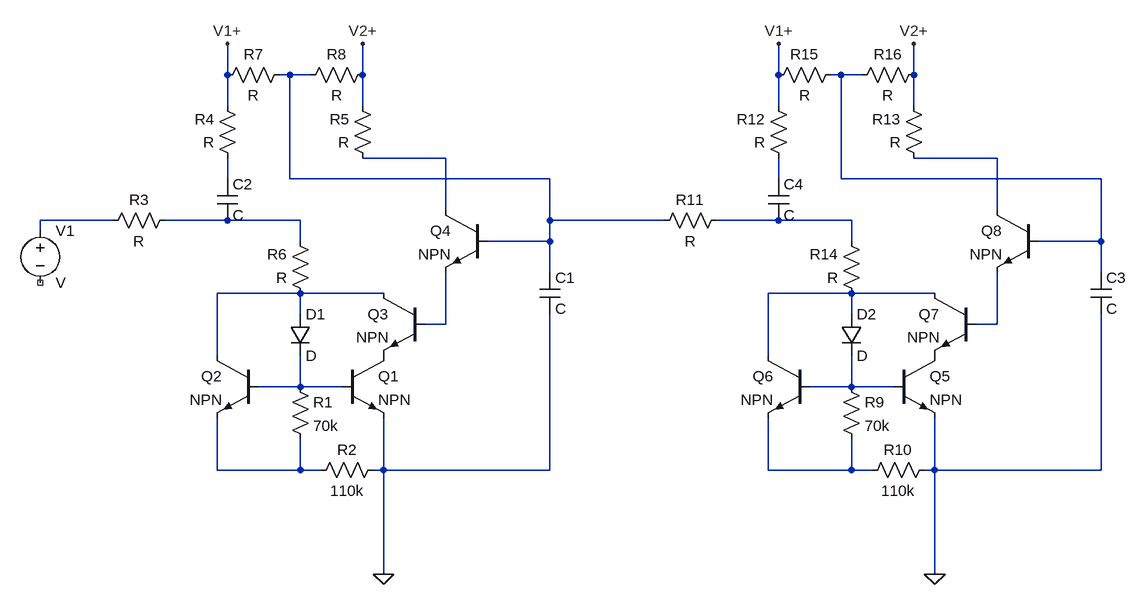
[diagram p0: schematic phantom current corrector.asc]
phantom current corrector.asc, the LTspice schematic file:
Version 4.1
SHEET 1 1512 680
WIRE 128 -304 128 -352
WIRE 224 -304 208 -304
WIRE 256 -304 224 -304
WIRE 336 -304 336 -352
WIRE 976 -304 976 -352
WIRE 1072 -304 1056 -304
WIRE 1104 -304 1072 -304
WIRE 1184 -304 1184 -352
WIRE 128 -256 128 -304
WIRE 336 -256 336 -304
WIRE 976 -256 976 -304
WIRE 1184 -256 1184 -304
WIRE 464 -176 336 -176
WIRE 1312 -176 1184 -176
WIRE 128 -144 128 -176
WIRE 224 -144 224 -304
WIRE 624 -144 224 -144
WIRE 976 -144 976 -176
WIRE 1072 -144 1072 -304
WIRE 1472 -144 1072 -144
WIRE 464 -96 464 -176
WIRE 1312 -96 1312 -176
WIRE -48 -80 -160 -80
WIRE 128 -80 32 -80
WIRE 240 -80 128 -80
WIRE 624 -80 624 -144
WIRE 800 -80 624 -80
WIRE 976 -80 880 -80
WIRE 1088 -80 976 -80
WIRE -160 -64 -160 -80
WIRE 240 -48 240 -80
WIRE 624 -48 624 -80
WIRE 624 -48 528 -48
WIRE 1088 -48 1088 -80
WIRE 1472 -48 1472 -144
WIRE 1472 -48 1376 -48
WIRE 624 0 624 -48
WIRE 1472 0 1472 -48
WIRE 240 32 112 32
WIRE 368 32 240 32
WIRE 1088 32 960 32
WIRE 1216 32 1088 32
WIRE 240 64 240 32
WIRE 1088 64 1088 32
WIRE 464 80 464 0
WIRE 464 80 432 80
WIRE 1312 80 1312 0
WIRE 1312 80 1280 80
WIRE 112 128 112 32
WIRE 960 128 960 32
WIRE 240 176 240 128
WIRE 240 176 176 176
WIRE 304 176 240 176
WIRE 1088 176 1088 128
WIRE 1088 176 1024 176
WIRE 1152 176 1088 176
WIRE 112 304 112 224
WIRE 240 304 240 256
WIRE 240 304 112 304
WIRE 272 304 240 304
WIRE 368 304 368 224
WIRE 368 304 352 304
WIRE 624 304 624 64
WIRE 624 304 368 304
WIRE 960 304 960 224
WIRE 1088 304 1088 256
WIRE 1088 304 960 304
WIRE 1120 304 1088 304
WIRE 1216 304 1216 224
WIRE 1216 304 1200 304
WIRE 1472 304 1472 64
WIRE 1472 304 1216 304
WIRE 368 464 368 304
WIRE 1216 464 1216 304
FLAG 368 464 0
FLAG 128 -352 V1+
FLAG 336 -352 V2+
FLAG 1216 464 0
FLAG 976 -352 V1+
FLAG 1184 -352 V2+
SYMBOL npn 304 128 R0
SYMATTR InstName Q1
SYMBOL npn 176 128 M0
SYMATTR InstName Q2
SYMBOL diode 224 64 R0
SYMATTR InstName D1
SYMBOL res 224 160 R0
SYMATTR InstName R1
SYMATTR Value 70k
SYMBOL res 368 288 R90
WINDOW 0 0 56 VBottom 2
WINDOW 3 32 56 VTop 2
SYMATTR InstName R2
SYMATTR Value 110k
SYMBOL npn 432 32 M0
SYMATTR InstName Q3
SYMBOL npn 528 -96 M0
SYMATTR InstName Q4
SYMBOL cap 608 0 R0
SYMATTR InstName C1
SYMBOL res 48 -96 R90
WINDOW 0 0 56 VBottom 2
WINDOW 3 32 56 VTop 2
SYMATTR InstName R3
SYMBOL res 144 -160 R180
WINDOW 0 36 76 Left 2
WINDOW 3 36 40 Left 2
SYMATTR InstName R4
SYMBOL res 352 -160 R180
WINDOW 0 36 76 Left 2
WINDOW 3 36 40 Left 2
SYMATTR InstName R5
SYMBOL res 256 48 R180
WINDOW 0 36 76 Left 2
WINDOW 3 36 40 Left 2
SYMATTR InstName R6
SYMBOL cap 112 -144 R0
SYMATTR InstName C2
SYMBOL res 224 -320 R90
WINDOW 0 0 56 VBottom 2
WINDOW 3 32 56 VTop 2
SYMATTR InstName R7
SYMBOL res 352 -320 R90
WINDOW 0 0 56 VBottom 2
WINDOW 3 32 56 VTop 2
SYMATTR InstName R8
SYMBOL npn 1152 128 R0
SYMATTR InstName Q5
SYMBOL npn 1024 128 M0
SYMATTR InstName Q6
SYMBOL diode 1072 64 R0
SYMATTR InstName D2
SYMBOL res 1072 160 R0
SYMATTR InstName R9
SYMATTR Value 70k
SYMBOL res 1216 288 R90
WINDOW 0 0 56 VBottom 2
WINDOW 3 32 56 VTop 2
SYMATTR InstName R10
SYMATTR Value 110k
SYMBOL npn 1280 32 M0
SYMATTR InstName Q7
SYMBOL npn 1376 -96 M0
SYMATTR InstName Q8
SYMBOL cap 1456 0 R0
SYMATTR InstName C3
SYMBOL res 896 -96 R90
WINDOW 0 0 56 VBottom 2
WINDOW 3 32 56 VTop 2
SYMATTR InstName R11
SYMBOL res 992 -160 R180
WINDOW 0 36 76 Left 2
WINDOW 3 36 40 Left 2
SYMATTR InstName R12
SYMBOL res 1200 -160 R180
WINDOW 0 36 76 Left 2
WINDOW 3 36 40 Left 2
SYMATTR InstName R13
SYMBOL res 1104 48 R180
WINDOW 0 36 76 Left 2
WINDOW 3 36 40 Left 2
SYMATTR InstName R14
SYMBOL cap 960 -144 R0
SYMATTR InstName C4
SYMBOL res 1072 -320 R90
WINDOW 0 0 56 VBottom 2
WINDOW 3 32 56 VTop 2
SYMATTR InstName R15
SYMBOL res 1200 -320 R90
WINDOW 0 0 56 VBottom 2
WINDOW 3 32 56 VTop 2
SYMATTR InstName R16
SYMBOL voltage -160 -80 R0
SYMATTR InstName V1

The netlist it stands for:
* phantom current corrector.asc
Q1 P001 N014 0 0 NPN
Q2 N010 N014 N016 0 NPN
D1 N010 N014 D
R1 N014 N016 70k
R2 0 N016 110k
Q3 N010 N012 P001 0 NPN
Q4 N003 N001 N012 0 NPN
C1 N001 0 C
R3 N008 N007 R
R4 N005 V1+ R
R5 N003 V2+ R
R6 N010 N008 R
C2 N005 N008 C
R7 N001 V1+ R
R8 V2+ N001 R
Q5 P002 N015 0 0 NPN
Q6 N011 N015 N017 0 NPN
D2 N011 N015 D
R9 N015 N017 70k
R10 0 N017 110k
Q7 N011 N013 P002 0 NPN
Q8 N004 N002 N013 0 NPN
C3 N002 0 C
R11 N009 N001 R
R12 N006 V1+ R
R13 N004 V2+ R
R14 N011 N009 R
C4 N006 N009 C
R15 N002 V1+ R
R16 V2+ N002 R
V1 N007 NC_01 V
.model D D
.lib standard.dio
.model NPN NPN
.model PNP PNP
.lib standard.bjt
.backanno
.end